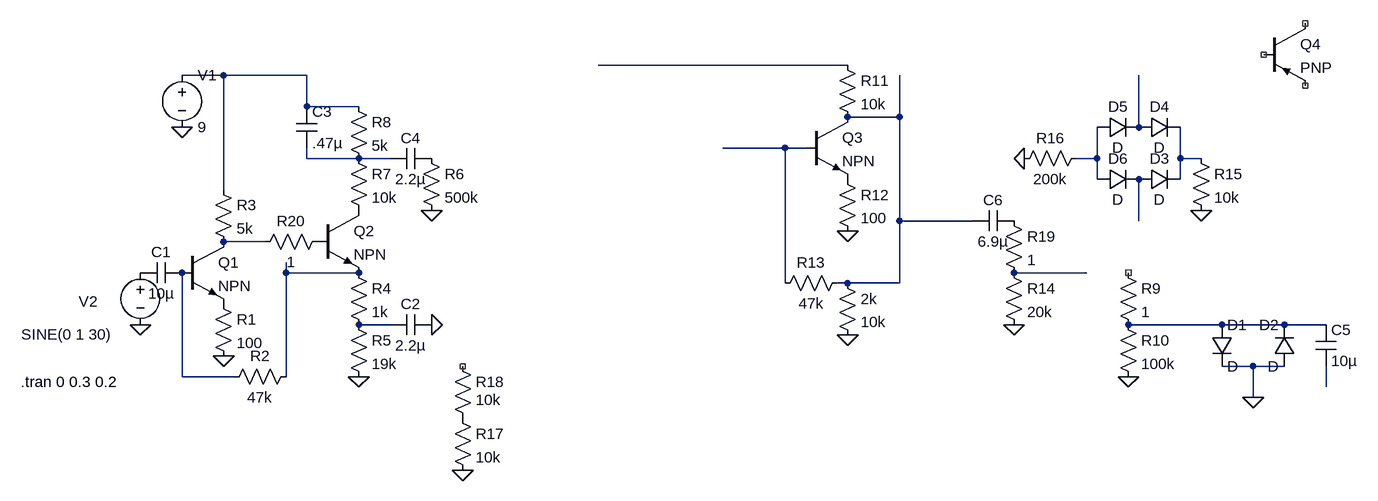
[diagram p0: schematic EthanFuzz1.asc]
EthanFuzz1.asc, the LTspice schematic file:
Version 4
SHEET 1 1448 680
WIRE 656 -288 272 -288
WIRE -304 -272 -368 -272
WIRE -176 -272 -304 -272
WIRE -176 -224 -176 -272
WIRE -96 -224 -176 -224
WIRE 736 -208 736 -272
WIRE 736 -208 656 -208
WIRE 1104 -192 1104 -272
WIRE 560 -160 464 -160
WIRE 592 -160 560 -160
WIRE -176 -144 -176 -160
WIRE -96 -144 -176 -144
WIRE -48 -144 -96 -144
WIRE 1040 -144 1040 -192
WIRE 1040 -144 1008 -144
WIRE 1168 -144 1168 -192
WIRE 1200 -144 1168 -144
WIRE 1040 -112 1040 -144
WIRE 1168 -112 1168 -144
WIRE -304 -96 -304 -272
WIRE 736 -48 736 -208
WIRE 848 -48 736 -48
WIRE 1104 -48 1104 -112
WIRE -240 -16 -304 -16
WIRE -208 32 -208 16
WIRE -96 32 -208 32
WIRE 1024 32 912 32
WIRE 560 48 560 -160
WIRE 656 48 640 48
WIRE 736 48 736 -48
WIRE 736 48 656 48
WIRE -48 112 -96 112
WIRE 1232 112 1088 112
WIRE 1328 112 1232 112
WIRE 1392 112 1328 112
WIRE 1280 176 1232 176
WIRE 1328 176 1280 176
WIRE -368 192 -368 32
WIRE -288 192 -368 192
WIRE -208 192 -208 32
WIRE 1392 208 1392 176
WIRE 1280 224 1280 176
FLAG -304 160 0
FLAG 16 112 0
FLAG 1088 192 0
FLAG -368 -192 0
FLAG -432 112 0
FLAG 1280 224 0
FLAG -96 192 0
FLAG 16 -64 0
FLAG 656 -32 0
FLAG 912 112 0
FLAG 1200 -64 0
FLAG 928 -144 0
FLAG 656 128 0
FLAG 64 336 0
SYMBOL cap -368 16 R90
WINDOW 0 0 32 VBottom 2
WINDOW 3 32 32 VTop 2
SYMATTR InstName C1
SYMATTR Value 10µ
SYMBOL npn -368 -16 R0
SYMATTR InstName Q1
SYMBOL res -320 64 R0
SYMATTR InstName R1
SYMATTR Value 100
SYMBOL res -192 176 R90
WINDOW 0 0 56 VBottom 2
WINDOW 3 32 56 VTop 2
SYMATTR InstName R2
SYMATTR Value 47k
SYMBOL res -320 -112 R0
SYMATTR InstName R3
SYMATTR Value 5k
SYMBOL npn -160 -64 R0
SYMATTR InstName Q2
SYMBOL res -112 16 R0
SYMATTR InstName R4
SYMATTR Value 1k
SYMBOL cap 16 96 R90
WINDOW 0 0 32 VBottom 2
WINDOW 3 32 32 VTop 2
SYMATTR InstName C2
SYMATTR Value 2.2µ
SYMBOL res -112 -160 R0
SYMATTR InstName R7
SYMATTR Value 10k
SYMBOL res -112 -240 R0
SYMATTR InstName R8
SYMATTR Value 5k
SYMBOL cap -192 -224 R0
SYMATTR InstName C3
SYMATTR Value .47µ
SYMBOL cap 16 -160 R90
WINDOW 0 0 32 VBottom 2
WINDOW 3 32 32 VTop 2
SYMATTR InstName C4
SYMATTR Value 2.2µ
SYMBOL res 1072 16 R0
SYMATTR InstName R9
SYMATTR Value 1
SYMBOL res 1072 96 R0
SYMATTR InstName R10
SYMATTR Value 100k
SYMBOL voltage -368 -288 R0
WINDOW 123 0 0 Left 0
WINDOW 39 0 0 Left 0
SYMATTR InstName V1
SYMATTR Value 9
SYMBOL voltage -432 16 R0
WINDOW 0 -95 60 Left 2
WINDOW 3 -183 111 Left 2
WINDOW 123 0 0 Left 0
WINDOW 39 0 0 Left 0
SYMATTR InstName V2
SYMATTR Value SINE(0 1 30)
SYMBOL diode 1216 112 R0
SYMATTR InstName D1
SYMBOL diode 1344 176 R180
WINDOW 0 24 64 Left 2
WINDOW 3 24 0 Left 2
SYMATTR InstName D2
SYMBOL res -112 96 R0
SYMATTR InstName R5
SYMATTR Value 19k
SYMBOL cap 1376 112 R0
SYMATTR InstName C5
SYMATTR Value 10µ
SYMBOL res 0 -160 R0
SYMATTR InstName R6
SYMATTR Value 500k
SYMBOL npn 592 -208 R0
SYMATTR InstName Q3
SYMBOL res 640 -304 R0
SYMATTR InstName R11
SYMATTR Value 10k
SYMBOL res 640 -128 R0
SYMATTR InstName R12
SYMATTR Value 100
SYMBOL res 656 32 R90
WINDOW 0 0 56 VBottom 2
WINDOW 3 32 56 VTop 2
SYMATTR InstName R13
SYMATTR Value 47k
SYMBOL cap 912 -64 R90
WINDOW 0 0 32 VBottom 2
WINDOW 3 32 32 VTop 2
SYMATTR InstName C6
SYMATTR Value 6.9µ
SYMBOL res 896 16 R0
SYMATTR InstName R14
SYMATTR Value 20k
SYMBOL pnp 1296 -352 R0
SYMATTR InstName Q4
SYMBOL diode 1040 -96 R270
WINDOW 0 32 32 VTop 2
WINDOW 3 0 32 VBottom 2
SYMATTR InstName D6
SYMBOL res 1184 -160 R0
SYMATTR InstName R15
SYMATTR Value 10k
SYMBOL diode 1104 -96 R270
WINDOW 0 32 32 VTop 2
WINDOW 3 0 32 VBottom 2
SYMATTR InstName D3
SYMBOL diode 1104 -176 R270
WINDOW 0 32 32 VTop 2
WINDOW 3 0 32 VBottom 2
SYMATTR InstName D4
SYMBOL diode 1040 -176 R270
WINDOW 0 32 32 VTop 2
WINDOW 3 0 32 VBottom 2
SYMATTR InstName D5
SYMBOL res 1024 -160 R90
WINDOW 0 0 56 VBottom 2
WINDOW 3 32 56 VTop 2
SYMATTR InstName R16
SYMATTR Value 200k
SYMBOL res 48 240 R0
SYMATTR InstName R17
SYMATTR Value 10k
SYMBOL res 640 32 R0
SYMATTR InstName 2k
SYMATTR Value 10k
SYMBOL res 48 160 R0
WINDOW 3 36 68 Left 2
SYMATTR Value 10k
SYMATTR InstName R18
SYMBOL res 896 -64 R0
SYMATTR InstName R19
SYMATTR Value 1
SYMBOL res -144 -32 R90
WINDOW 0 0 56 VBottom 2
WINDOW 3 32 56 VTop 2
SYMATTR InstName R20
SYMATTR Value 1
TEXT -616 200 Left 2 !.tran 0 0.3 0.2

The netlist it stands for:
* EthanFuzz1.asc
C1 N015 P001 10µ
Q1 N010 N015 P002 0 NPN
R1 P002 0 100
R2 N011 N015 47k
R3 N002 N010 5k
Q2 P003 P004 N011 0 NPN
R4 N011 N013 1k
C2 0 N013 2.2µ
R7 N006 P003 10k
R8 N002 N006 5k
C3 N002 N006 .47µ
C4 P005 N006 2.2µ
R9 NC_01 N014 1
R10 N014 0 100k
V1 N002 0 9
V2 P001 0 SINE(0 1 30)
D1 N014 0 D
D2 0 N014 D
R5 N013 0 19k
C5 N014 N016 10µ
R6 P005 0 500k
Q3 N003 N005 P006 0 NPN
R11 N001 N003 10k
R12 P006 0 100
R13 N003 N005 47k
C6 P007 N003 6.9µ
R14 N012 0 20k
Q4 NC_02 NC_03 NC_04 0 PNP
D6 N007 N009 D
R15 N008 0 10k
D3 N009 N008 D
D4 N004 N008 D
D5 N007 N004 D
R16 N007 0 200k
R17 P008 0 10k
R§2k N003 0 10k
R18 NC_05 P008 10k
R19 P007 N012 1
R20 P004 N010 1
.model D D
.lib standard.dio
.model NPN NPN
.model PNP PNP
.lib standard.bjt
.tran 0 0.3 0.2
.backanno
.end